# EAGLE design ROM-Adapter1 (EAGLE 9.6.2)
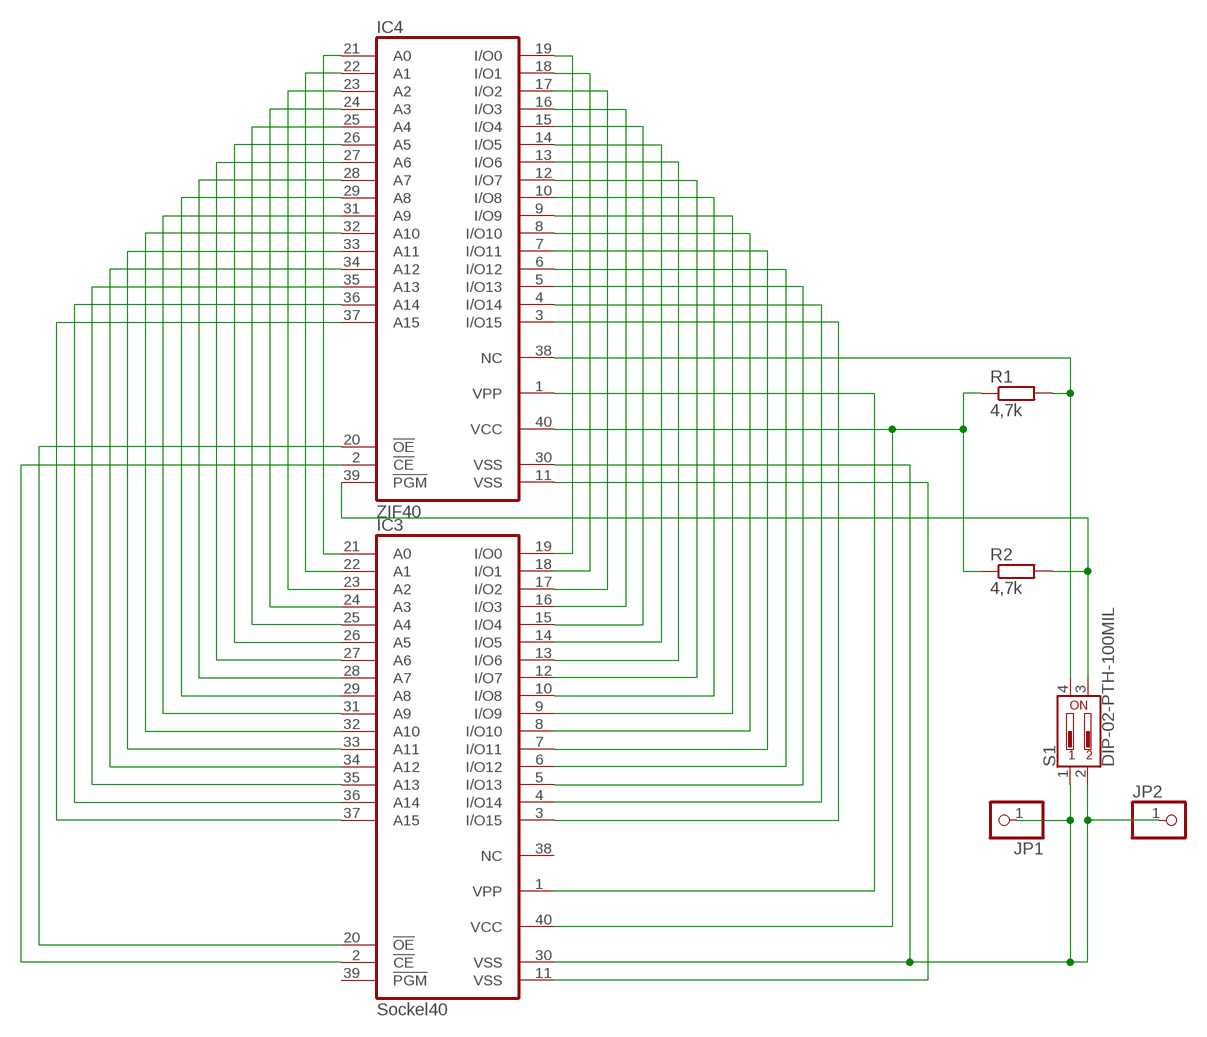
[diagram p0: schematic, sheet 1]

## Parts
IC3  Sockel40  27C1024HG  [DIL40]
IC4  ZIF40  MEMORY-HITACHI_27C1024HGZIF40  [MEMORY-HITACHI_ZIF40]
JP1  PINHD-1X1  [1X01]
JP2  PINHD-1X1  [1X01]
R1  4,7k  R-EU_0207/10  [0207/10]
R2  4,7k  R-EU_0207/10  [0207/10]
S1  DIP-02-PTH-100MIL  [DIPSWITCH-02-209-2LPST]

## Nets
N$1: IC3.21(A0) IC4.21(A0)
N$2: IC3.22(A1) IC4.22(A1)
N$3: IC3.23(A2) IC4.23(A2)
N$4: IC3.24(A3) IC4.24(A3)
N$5: IC3.25(A4) IC4.25(A4)
N$6: IC3.26(A5) IC4.26(A5)
N$7: IC3.27(A6) IC4.27(A6)
N$8: IC3.28(A7) IC4.28(A7)
N$9: IC3.29(A8) IC4.29(A8)
N$10: IC3.31(A9) IC4.31(A9)
N$11: IC3.32(A10) IC4.32(A10)
N$12: IC3.33(A11) IC4.33(A11)
N$13: IC3.34(A12) IC4.34(A12)
N$14: IC3.35(A13) IC4.35(A13)
N$15: IC3.36(A14) IC4.36(A14)
N$16: IC3.37(A15) IC4.37(A15)
N$17: IC3.20(!OE) IC4.20(!OE)
N$18: IC3.2(!CE) IC4.2(!CE)
N$19: IC4.38(NC) R1.2 S1.4
N$20: IC3.19(I/O0) IC4.19(I/O0)
N$21: IC3.18(I/O1) IC4.18(I/O1)
N$22: IC3.17(I/O2) IC4.17(I/O2)
N$23: IC3.16(I/O3) IC4.16(I/O3)
N$24: IC3.15(I/O4) IC4.15(I/O4)
N$25: IC3.14(I/O5) IC4.14(I/O5)
N$26: IC3.13(I/O6) IC4.13(I/O6)
N$27: IC3.12(I/O7) IC4.12(I/O7)
N$28: IC3.10(I/O8) IC4.10(I/O8)
N$29: IC3.9(I/O9) IC4.9(I/O9)
N$30: IC3.8(I/O10) IC4.8(I/O10)
N$31: IC3.7(I/O11) IC4.7(I/O11)
N$32: IC3.6(I/O12) IC4.6(I/O12)
N$33: IC3.5(I/O13) IC4.5(I/O13)
N$34: IC3.4(I/O14) IC4.4(I/O14)
N$35: IC3.3(I/O15) IC4.3(I/O15)
N$36: IC4.39(!PGM) R2.2 S1.3
N$37: IC3.1(VPP) IC4.1(VPP)
N$38: IC3.40(VCC) IC4.40(VCC) R1.1 R2.1
N$40: IC3.11(VSS) IC4.11(VSS)
N$42: IC3.30(VSS) IC4.30(VSS) JP1.1 JP2.1 S1.1 S1.2
Unconnected: IC3.38(NC) IC3.39(!PGM)

## Library data of the parts
IC3 = memory-hitachi:27C1024HG: MEMORY; OC_FARNELL: unknown; OC_NEWARK: unknown
IC4 = ROM-Adapter:MEMORY-HITACHI_27C1024HG: MEMORY
JP1 JP2 = pinhead:PINHD-1X1: PIN HEADER
R1 R2 = rcl:R-EU_: RESISTOR, European symbol; SPICEPREFIX: R
S1 = SparkFun-Switches:DIP-02: 2-Position DIP Switch 2-circuit DIP (dual inline package) switch. Commonly used to physcially set a circuit's behavior. Variants PTH-100MIL - Through-hole, 0.1"-Pitch Used on SparkFun Stepoko <https://www.sparkfun.com/products/13899> (ROB-13899) SMD-50MIL-JWING - SMD (J-Wing Pads), 0.05"-Pitch Prototype Part SMD-50MIL - SMD, 0.05"-Pitch Used on SparkFun Battery Babysitter <https://www.sparkfun.com/products/13777> (PRT-13777); PROD_ID: SWCH-12532

## Board
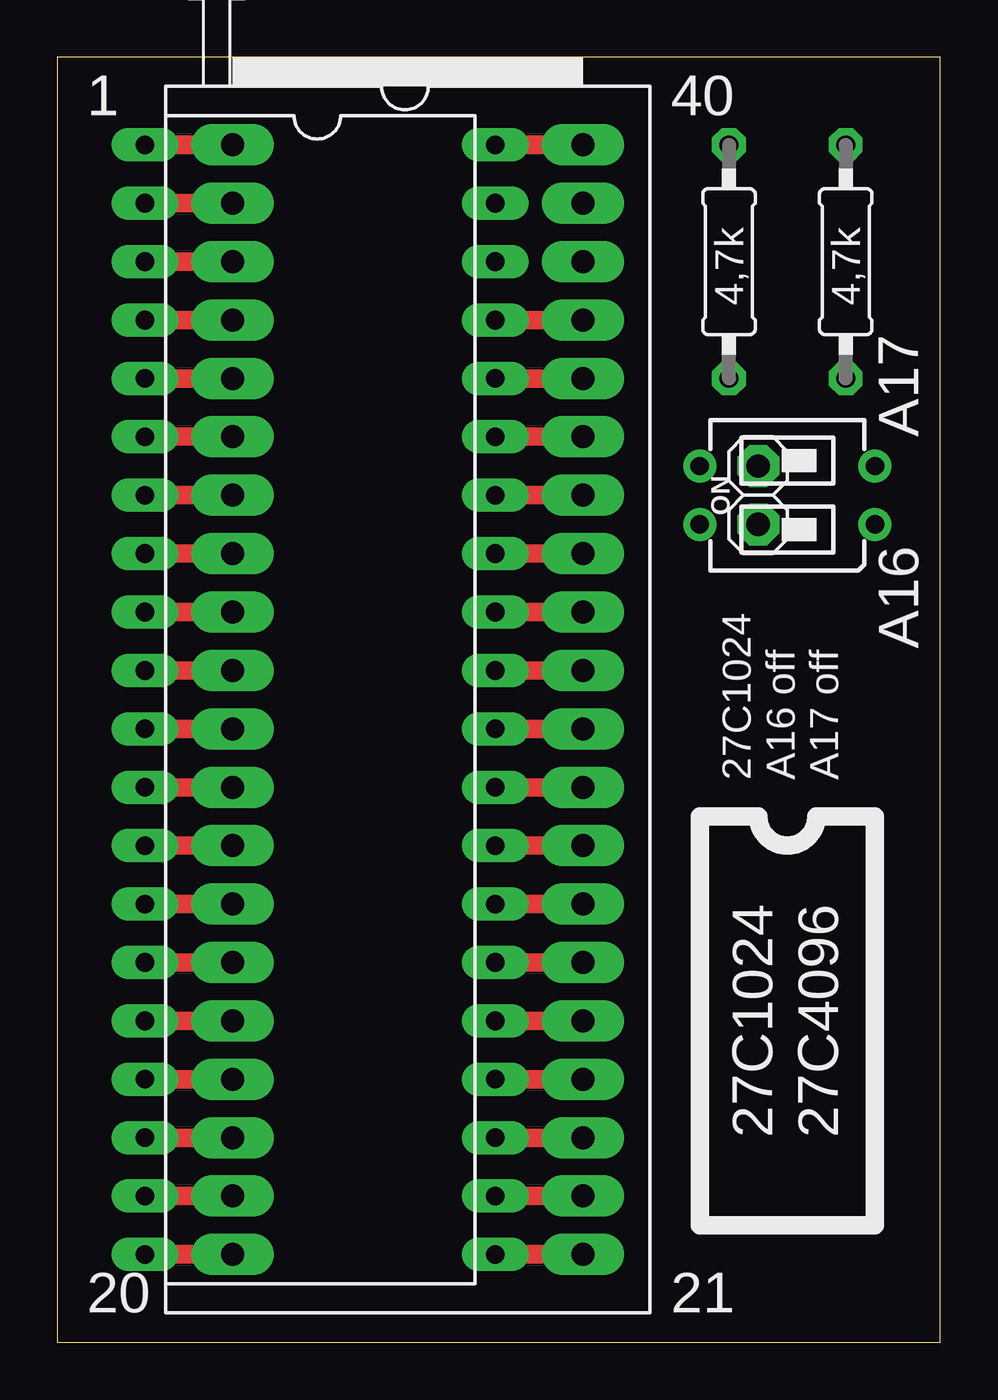
[diagram p1: board, top side]
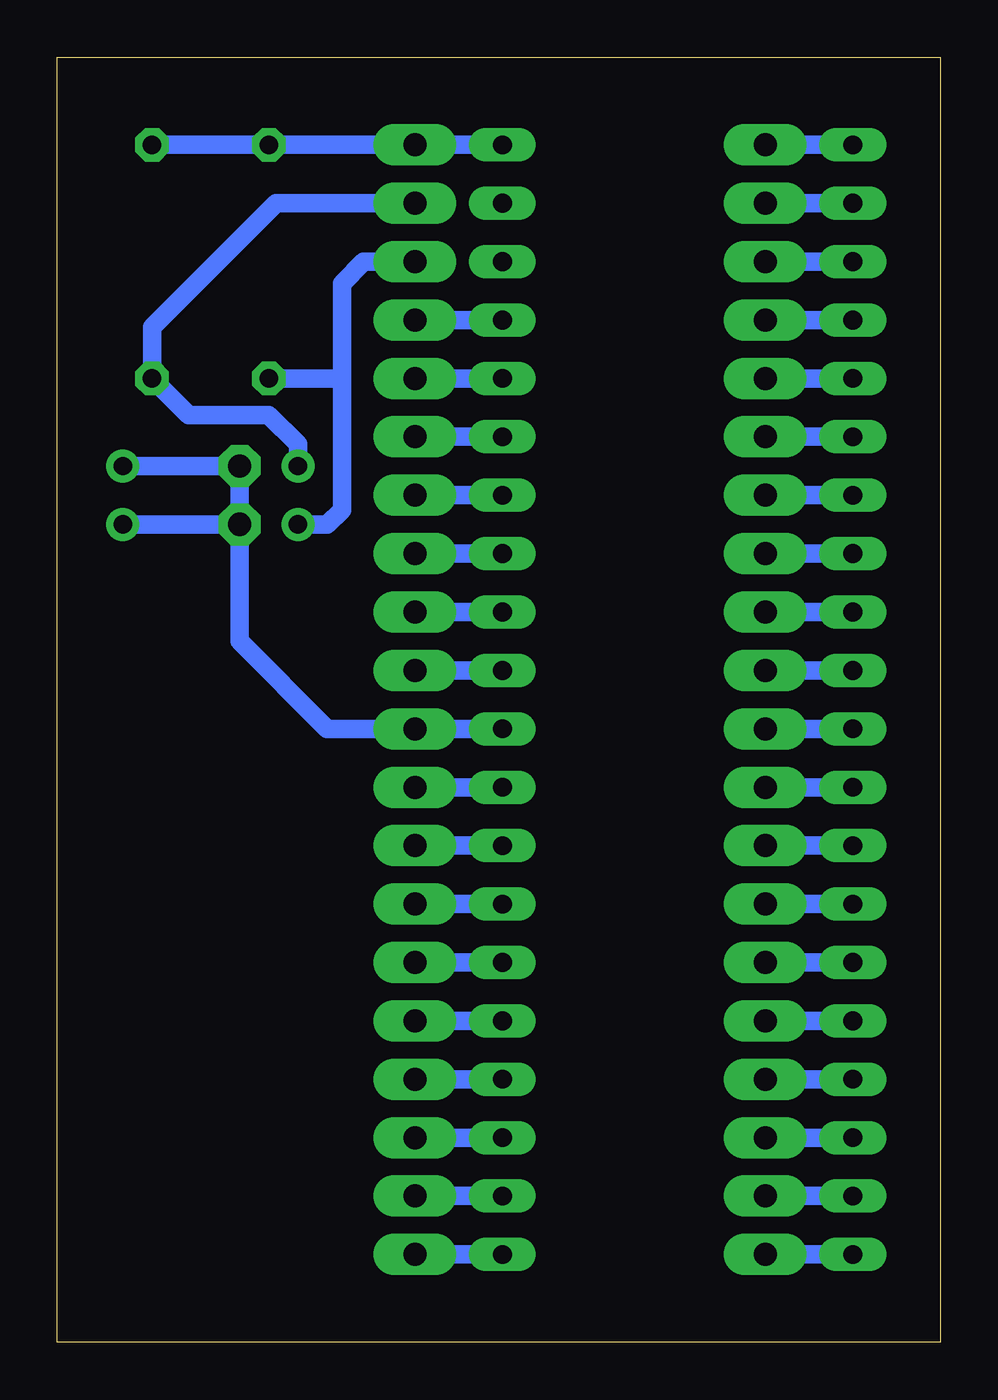
[diagram p2: board, bottom side, seen from below]

Size 38.41 x 55.87 mm. Coordinates in mm from the lower left corner, seen from the top.
Outline: 0,0 38.41,0 38.41,55.87 0,55.87 0,0
Copper layers (1*16): Top 0.035mm / dielectric 1.6mm / Bottom 0.035mm
Design rules "jlcpcb-2layers": minimum track width 5mil, minimum drill 0.3mm, track to track 5mil, track to pad 5mil, pad to pad 5mil, via to via 5mil, smd to smd 5mil, copper to edge 0.2mm, drill to drill 6mil, minimum pad ring 10mil, minimum via ring 3mil, stop-mask expansion 4mil, vias tented up to drill 0mil, thermal gap 10mil

### Footprints (pad centres in the part's own frame; a part is rotated, then mirrored left to right if it is on the bottom)
DIL40 = drill 0.813 long: 1 -24.13,-7.62; 2 -21.59,-7.62; 3 -19.05,-7.62; 4 -16.51,-7.62; 5 -13.97,-7.62; 6 -11.43,-7.62; 7 -8.89,-7.62; 8 -6.35,-7.62; 9 -3.81,-7.62; 10 -1.27,-7.62; 11 1.27,-7.62; 12 3.81,-7.62; 13 6.35,-7.62; 14 8.89,-7.62; 15 11.43,-7.62; 16 13.97,-7.62; 17 16.51,-7.62; 18 19.05,-7.62; 19 21.59,-7.62; 20 24.13,-7.62; 21 24.13,7.62; 22 21.59,7.62; 23 19.05,7.62; 24 16.51,7.62; 25 13.97,7.62; 26 11.43,7.62; 27 8.89,7.62; 28 6.35,7.62; 29 3.81,7.62; 30 1.27,7.62; 31 -1.27,7.62; 32 -3.81,7.62; 33 -6.35,7.62; 34 -8.89,7.62; 35 -11.43,7.62; 36 -13.97,7.62; 37 -16.51,7.62; 38 -19.05,7.62; 39 -21.59,7.62; 40 -24.13,7.62
MEMORY-HITACHI_ZIF40 = drill 1 long: 1 -24.13,-7.62; 2 -21.59,-7.62; 3 -19.05,-7.62; 4 -16.51,-7.62; 5 -13.97,-7.62; 6 -11.43,-7.62; 7 -8.89,-7.62; 8 -6.35,-7.62; 9 -3.81,-7.62; 10 -1.27,-7.62; 11 1.27,-7.62; 12 3.81,-7.62; 13 6.35,-7.62; 14 8.89,-7.62; 15 11.43,-7.62; 16 13.97,-7.62; 17 16.51,-7.62; 18 19.05,-7.62; 19 21.59,-7.62; 20 24.13,-7.62; 21 24.13,7.62; 22 21.59,7.62; 23 19.05,7.62; 24 16.51,7.62; 25 13.97,7.62; 26 11.43,7.62; 27 8.89,7.62; 28 6.35,7.62; 29 3.81,7.62; 30 1.27,7.62; 31 -1.27,7.62; 32 -3.81,7.62; 33 -6.35,7.62; 34 -8.89,7.62; 35 -11.43,7.62; 36 -13.97,7.62; 37 -16.51,7.62; 38 -19.05,7.62; 39 -21.59,7.62; 40 -24.13,7.62
1X01 = drill 1.016 octagon: 1 0,0
0207/10 = drill 0.813 octagon: 1 -5.08,0; 2 5.08,0
DIPSWITCH-02-209-2LPST = drill 0.8: 1 -1.27,-3.81; 2 1.27,-3.81; 3 1.27,3.81; 4 -1.27,3.81

### Placement (x,y rotation side)
IC3  11.43,27.94 270 top
IC4  15.24,27.94 270 top
JP1  30.48,38.1 0 top
JP2  30.48,35.56 0 top
R1  29.21,46.99 270 top
R2  34.29,46.99 270 top
S1  31.75,36.83 90 top

### Tracks (layer width: path | path; a pad name or v marks a point on that pad's centre or on a via)
N$1
  Top 0.813: IC3.21 IC4.21
  Bottom 0.813: IC3.21 IC4.21
N$2
  Top 0.813: IC3.22 IC4.22
  Bottom 0.813: IC4.22 IC3.22
N$3
  Top 0.813: IC3.23 IC4.23
  Bottom 0.813: IC4.23 IC3.23
N$4
  Top 0.813: IC3.24 IC4.24
  Bottom 0.813: IC4.24 IC3.24
N$5
  Top 0.813: IC3.25 IC4.25
  Bottom 0.813: IC4.25 IC3.25
N$6
  Top 0.813: IC3.26 IC4.26
  Bottom 0.813: IC4.26 IC3.26
N$7
  Top 0.813: IC3.27 IC4.27
  Bottom 0.813: IC4.27 IC3.27
N$8
  Top 0.813: IC3.28 IC4.28
  Bottom 0.813: IC3.28 IC4.28
N$9
  Top 0.813: IC3.29 IC4.29
  Bottom 0.813: IC3.29 IC4.29
N$10
  Top 0.813: IC3.31 IC4.31
  Bottom 0.813: IC3.31 IC4.31
N$11
  Top 0.813: IC3.32 IC4.32
  Bottom 0.813: IC3.32 IC4.32
N$12
  Top 0.813: IC3.33 IC4.33
  Bottom 0.813: IC3.33 IC4.33
N$13
  Top 0.813: IC3.34 IC4.34
  Bottom 0.813: IC3.34 IC4.34
N$14
  Top 0.813: IC3.35 IC4.35
  Bottom 0.813: IC3.35 IC4.35
N$15
  Top 0.813: IC3.36 IC4.36
  Bottom 0.813: IC3.36 IC4.36
N$16
  Top 0.813: IC3.37 IC4.37
  Bottom 0.813: IC3.37 IC4.37
N$17
  Top 0.813: IC3.20 IC4.20
  Bottom 0.813: IC3.20 IC4.20
N$18
  Top 0.813: IC3.2 IC4.2
  Bottom 0.813: IC3.2 IC4.2
N$19
  Bottom 0.813: S1.4 26.67,35.56 26.04,36.2 26.04,41.91 | IC4.38 25.08,46.99 26.04,46.04 26.04,41.91 | R1.2 26.04,41.91
N$20
  Top 0.813: IC3.19 IC4.19
  Bottom 0.813: IC3.19 IC4.19
N$21
  Top 0.813: IC3.18 IC4.18
  Bottom 0.813: IC3.18 IC4.18
N$22
  Top 0.813: IC3.17 IC4.17
  Bottom 0.813: IC3.17 IC4.17
N$23
  Top 0.813: IC3.16 IC4.16
  Bottom 0.813: IC3.16 IC4.16
N$24
  Top 0.813: IC3.15 IC4.15
  Bottom 0.813: IC3.15 IC4.15
N$25
  Top 0.813: IC3.14 IC4.14
  Bottom 0.813: IC3.14 IC4.14
N$26
  Top 0.813: IC3.13 IC4.13
  Bottom 0.813: IC3.13 IC4.13
N$27
  Top 0.813: IC3.12 IC4.12
  Bottom 0.813: IC3.12 IC4.12
N$28
  Top 0.813: IC3.10 IC4.10
  Bottom 0.813: IC3.10 IC4.10
N$29
  Top 0.813: IC3.9 IC4.9
  Bottom 0.813: IC3.9 IC4.9
N$30
  Top 0.813: IC3.8 IC4.8
  Bottom 0.813: IC3.8 IC4.8
N$31
  Top 0.813: IC3.7 IC4.7
  Bottom 0.813: IC3.7 IC4.7
N$32
  Top 0.813: IC3.6 IC4.6
  Bottom 0.813: IC3.6 IC4.6
N$33
  Top 0.813: IC3.5 IC4.5
  Bottom 0.813: IC3.5 IC4.5
N$34
  Top 0.813: IC3.4 IC4.4
  Bottom 0.813: IC3.4 IC4.4
N$35
  Top 0.813: IC3.3 IC4.3
  Bottom 0.813: IC3.3 IC4.3
N$36
  Bottom 0.813: S1.3 27.94,39.05 29.21,40.32 32.7,40.32 R2.2 34.29,44.13 28.89,49.53 IC4.39
N$37
  Top 0.813: IC3.1 IC4.1
  Bottom 0.813: IC3.1 IC4.1
N$38
  Top 0.813: IC3.40 IC4.40
  Bottom 0.813: IC3.40 IC4.40 R1.1 R2.1
N$40
  Top 0.813: IC3.11 IC4.11
  Bottom 0.813: IC3.11 IC4.11
N$42
  Top 0.813: IC3.30 IC4.30
  Bottom 0.813: IC3.30 IC4.30 26.67,26.67 30.48,30.48 JP2.1 | JP2.1 JP1.1 S1.2 | JP2.1 S1.1

### Text on the board
tPlace: 1 | 40 | 4,7k | 4,7k | A17 | A16 | 27C1024 / A16 off / A17 off | 27C1024 | 27C4096 | 20 | 21